# EAGLE design open-lab-VUSB-A (EAGLE 6.5.0)
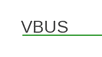
[diagram p0: schematic, sheet 1, part 1 of 2]
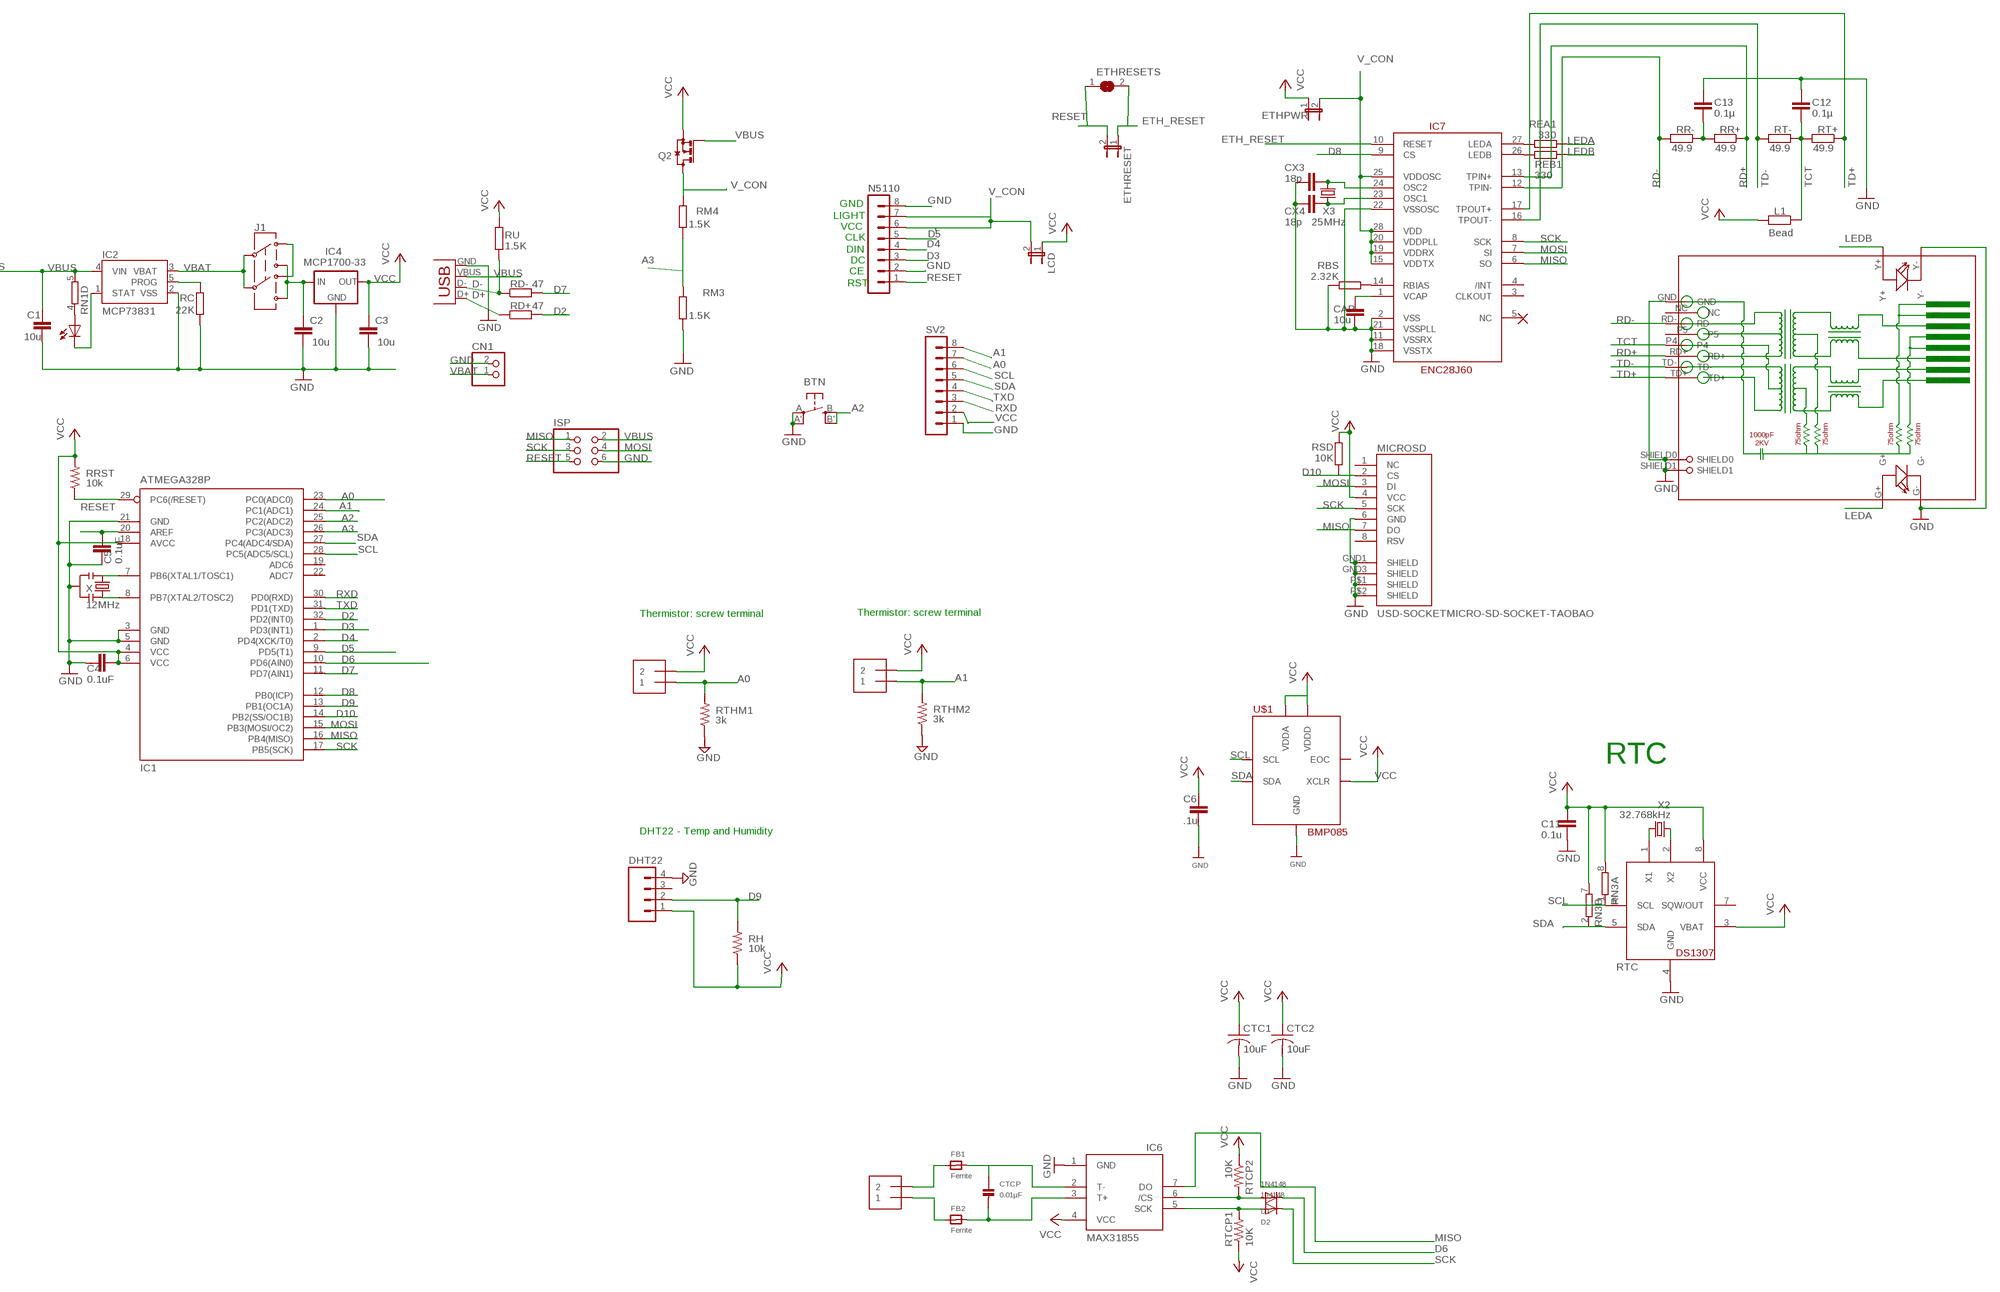
[diagram p1: schematic, sheet 1, part 2 of 2]

## Parts
BTN  EVQQ2  [EVQ-Q2]
C1  10u  C-EUC0805  [C0805]
C2  10u  C-EUC0805  [C0805]
C3  10u  C-EUC0805  [C0805]
C4  0.1uF  C-EUC0805  [C0805]
C5  0.1uF  C-EUC0805  [C0805]
C6  .1u  C-EUC0805  [C0805]
C11  0.1u  C-EUC0805  [C0805]
C12  0.1µ  C-EUC0805  [C0805]
C13  0.1µ  C-EUC0805  [C0805]
CAP  10u  C-EUC0805  [C0805]
CHG  0805  LEDCHIPLED_0805  [CHIPLED_0805]
CN1  JST_2PIN-SMT-RA  [JST-PH-2-SMT-RA]
CTC1  10uF  C-USC0805K  [C0805K]
CTC2  10uF  C-USC0805K  [C0805K]
CTCP  0.01µF  CAP_CERAMIC_0805  [_0805]
CX3  18p  C-EUC0805  [C0805]
CX4  18p  C-EUC0805  [C0805]
D1  1N4148  DIODESOD-323F  [SOD-323F]
D2  1n4148  DIODESOD-323F  [SOD-323F]
DHT22  M04LOCK  [1X04_LOCK]
ETHPWR  JP1E  [JP1]
ETHRESET  JP1E  [JP1]
ETHRESETS  SJ  [SJ]
FB1  Ferrite  FERRITE_0805  [_0805]
FB2  Ferrite  FERRITE_0805  [_0805]
IC1  ATMEGA328P  MEGA8-AI  [TQFP32-08]
IC2  MCP73831  [SOT23-5]
IC4  MCP1700-33  MCP1700SOT233  [SOT23]
IC6  MAX31855  MAX6675  [SO08]
IC7  ENC28J60  ENC28J60SO28LONG  [SOIC28WLONG]
ISP  PINHD-2X3  [2X03]
J1  AYZ0202  [AYZ0202]
L1  Bead  R-EU_R0805  [R0805]
LCD  JP1E  [JP1]
MICROSD  USD-SOCKETMICRO-SD-SOCKET-TAOBAO  [MICRO-SD-SOCKET-TAOBAO]
N5110  MA08-1  [MA08-1]
Q2  BSS123  [SOT23]
RBS  2.32K  R-EU_R0805  [R0805]
RC  22K  R-EU_R0805  [R0805]
RD+  47  R-EU_R0805  [R0805]
RD-  47  R-EU_R0805  [R0805]
REA1  330  R-EU_R0805  [R0805]
REB1  330  R-EU_R0805  [R0805]
RH  10k  R-US_R0805  [R0805@1]
RJ45  HR911105A  [HR911105A]
RM3  1.5K  R-EU_R0805  [R0805]
RM4  1.5K  R-EU_R0805  [R0805]
RN1  4R-NEXB38V  [EXB38V]
RN3  4R-NEXB38V  [EXB38V]
RR+  49.9  R-EU_R0805  [R0805]
RR-  49.9  R-EU_R0805  [R0805]
RRST  10k  R-US_R0805  [R0805@1]
RSD  10K  R-EU_R0805  [R0805]
RT+  49.9  R-EU_R0805  [R0805]
RT-  49.9  R-EU_R0805  [R0805]
RTC  DS1307  DS1307SOIC  [SO08]
RTCP1  10K  R-US_R0805  [R0805]
RTCP2  10K  R-US_R0805  [R0805]
RTHM1  3k  R-US_R0805  [R0805@1]
RTHM2  3k  R-US_R0805  [R0805@1]
RU  1.5K  R-EU_R0805  [R0805]
SV2  MA08-1  [MA08-1]
TCPL  1X2-3.5MM  [1X2-3.5MM]
THM1  1X2-3.5MM  [1X2-3.5MM]
THM2  1X2-3.5MM  [1X2-3.5MM]
U$1  BMP085  [BMP085]
X  12MHz  RESONATORSMD  [RESONATOR-SMD]
X1  USBSMD  [USB-MINIB]
X2  32.768kHz  CRYSTALTC26H  [TC26H]
X3  25MHz  CRYSTALHC49UV  [HC49U-V]

## Nets
A0: IC1.23(PC0(ADC0)) RTHM1.2 SV2.7 THM1.1
A1: IC1.24(PC1(ADC1)) RTHM2.2 SV2.8 THM2.1
A2: BTN.B'(S1) BTN.B(S) IC1.25(PC2(ADC2))
A3: IC1.26(PC3(ADC3)) RM3.2 RM4.1
AREF: C5.2 IC1.20(AREF)
CS: D1.A IC6.6(/CS) RTCP2.2
D2: IC1.32(PD2(INT0)) RD+.2
D3: IC1.1(PD3(INT1)) N5110.3
D4: IC1.2(PD4(XCK/T0)) N5110.4
D5: IC1.9(PD5(T1)) N5110.5
D6: D1.C IC1.10(PD6(AIN0))
D7: IC1.11(PD7(AIN1)) RD-.2
D8: IC1.12(PB0(ICP)) IC7.9(CS)
D9: DHT22.2 IC1.13(PB1(OC1A)) RH.2
D10: IC1.14(PB2(SS/OC1B)) MICROSD.2(CS) RSD.1
D+: RD+.1 X1.D+
D-: RD-.1 RU.1 X1.D-
ETH_RESET: ETHRESET.1 ETHRESETS.2 IC7.10(RESET)
GND: BTN.A'(P1) BTN.A(P) C1.2 C2.2 C3.2 C4.1 C5.1 C6.2 C11.2 C12.1 C13.1 CAP.2 CN1.2 CTC1.2 CTC2.2 CX3.2 CX4.2 DHT22.4 IC1.3(GND) IC1.5(GND) IC1.21(GND) IC2.2(VSS) IC4.1(GND) IC6.1(GND) IC7.2(VSS) IC7.11(VSSRX) IC7.18(VSSTX) IC7.21(VSSPLL) IC7.22(VSSOSC) ISP.6 MICROSD.6(GND) MICROSD.GND1(SHIELD) MICROSD.GND3(SHIELD) MICROSD.P$1(SHIELD) MICROSD.P$2(SHIELD) N5110.2 RBS.1 RC.1 RJ45.G- RJ45.GND RJ45.SHIELD0 RJ45.SHIELD1 RJ45.Y- RM3.1 RTC.4(GND) RTHM1.1 RTHM2.1 SV2.1 U$1.P$1(GND) X1.GND X.2
LEDA: REA1.2 RJ45.G+
LEDB: REB1.2 RJ45.Y+
MISO: IC1.16(PB4(MISO)) IC6.7(DO) IC7.6(SO) ISP.1 MICROSD.7(DO)
MOSI: IC1.15(PB3(MOSI/OC2)) IC7.7(SI) ISP.4 MICROSD.3(DI)
N$1: J1.3 J1.6
N$2: IC1.7(PB6(XTAL1/TOSC1)) X.1
N$3: IC1.8(PB7(XTAL2/TOSC2)) X.3
N$5: CHG.C IC2.1(STAT)
N$6: IC2.5(PROG) RC.2
N$8: FB1.1 TCPL.2
N$9: CTCP.1 FB1.2 IC6.2(T-)
N$10: CHG.A RN1.4
N$11: FB2.1 TCPL.1
N$12: CTCP.2 FB2.2 IC6.3(T+)
N$21: RTC.1(X1) X2.2
N$30: RTC.2(X2) X2.1
N$34: IC7.27(LEDA) REA1.1
N$37: IC7.26(LEDB) REB1.1
N$39: CAP.1 IC7.1(VCAP)
N$41: CX3.1 IC7.24(OSC2) X3.2
N$42: CX4.1 IC7.23(OSC1) X3.1
N$54: C13.2 RR+.2 RR-.1
N$59: IC7.14(RBIAS) RBS.2
RD+: IC7.13(TPIN+) RJ45.RD+ RR+.1
RD-: IC7.12(TPIN-) RJ45.RD- RR-.2
RESET: ETHRESET.2 ETHRESETS.1 IC1.29(PC6(/RESET)) ISP.5 N5110.1 RRST.1
RXD: IC1.30(PD0(RXD)) SV2.3
SCK: D2.C IC1.17(PB5(SCK)) IC7.8(SCK) ISP.3 MICROSD.5(SCK)
SCK1: D2.A IC6.5(SCK) RTCP1.2
SCL: IC1.28(PC5(ADC5/SCL)) RN3.1 RTC.6(SCL) SV2.6 U$1.P$6(SCL)
SDA: IC1.27(PC4(ADC4/SDA)) RN3.2 RTC.5(SDA) SV2.5 U$1.P$7(SDA)
TCT: C12.2 L1.1 RJ45.P4 RT+.2 RT-.1
TD+: IC7.17(TPOUT+) RJ45.TD+ RT+.1
TD-: IC7.16(TPOUT-) RJ45.TD- RT-.2
TXD: IC1.31(PD1(TXD)) SV2.4
V_CON: ETHPWR.2 IC7.15(VDDTX) IC7.19(VDDRX) IC7.20(VDDPLL) IC7.25(VDDOSC) IC7.28(VDD) LCD.2 N5110.6 N5110.7 Q2.3(D) RM4.2
VBAT: CN1.1 IC2.3(VBAT) J1.2 J1.5
VBUS: C1.1 IC2.4(VIN) ISP.2 Q2.1(G) RN1.5 X1.VBUS
VCC: C3.1 C4.2 C6.1 C11.1 CTC1.1 CTC2.1 DHT22.1 ETHPWR.1 IC1.4(VCC) IC1.6(VCC) IC1.18(AVCC) IC4.2(OUT) IC6.4(VCC) L1.2 LCD.1 MICROSD.4(VCC) Q2.2(S) RH.1 RN3.7 RN3.8 RRST.2 RSD.2 RTC.3(VBAT) RTC.8(VCC) RTCP1.1 RTCP2.1 RU.2 SV2.2 THM1.2 THM2.2 U$1.P$3(VDDA) U$1.P$4(VDDD) U$1.P$8(XCLR)
VDD: C2.1 IC4.3(IN) J1.1 J1.4
Unconnected: DHT22.3 IC1.19(ADC6) IC1.22(ADC7) IC7.3(CLKOUT) IC7.4(/INT) IC7.5(NC) MICROSD.1(NC) MICROSD.8(RSV) N5110.8 RJ45.NC RJ45.P5 RN1.1 RN1.2 RN1.3 RN1.6 RN1.7 RN1.8 RN3.3 RN3.4 RN3.5 RN3.6 RTC.7(SQW/OUT) U$1.P$2(EOC)

## Notes on the sheet
- GND
- LIGHT
- VCC
- CLK
- DIN
- DC
- CE
- RST
- Thermistor: screw terminal | Thermistor: screw terminal
- RTC
- DHT22 - Temp and Humidity

## Library data of the parts
BTN = adafruit:EVQQ2: SMT 6mm switch, EVQQ2 series http://www.ladyada.net/library/eagle
C1-C3 C6 C12 C13 CAP CX3 CX4 = resistor:C-EU: CAPACITOR, European symbol
C4 C5 C11 = rcl:C-EU: CAPACITOR, European symbol
CHG = led:LED: LED OSRAM: - CHIPLED LG R971, LG N971, LY N971, LG Q971, LY Q971, LO R971, LY R971 LH N974, LH R974 LS Q976, LO Q976, LY Q976 LO Q996 - Hyper CHIPLED LW Q18S LB Q993, LB Q99A, LB R99A - SideLED LS A670, LO A670, LY A670, LG A670, LP A670 LB A673, LV A673, LT A673, LW A673 LH A674 LY A675 LS A676, LA A676, LO A676, LY A676, LW A676 LS A679, LY A679, LG A679 - Hyper Micro SIDELED® LS Y876, LA Y876, LO Y876, LY Y876 LT Y87S - SmartLED LW L88C, LW L88S LB L89C, LB L89S, LG L890 LS L89K, LO L89K, LY L89K LS L896, LA L896, LO L896, LY L896 - TOPLED LS T670, LO T670, LY T670, LG T670, LP T670 LSG T670, LSP T670, LSY T670, LOP T670, LYG T670 LG T671, LOG T671, LSG T671 LB T673, LV T673, LT T673, LW T673 LH T674 LS T676, LA T676, LO T676, LY T676, LB T676, LH T676, LSB T676, LW T676 LB T67C, LV T67C, LT T67C, LS T67K, LO T67K, LY T67K, LW E67C LS E67B, LA E67B, LO E67B, LY E67B, LB E67C, LV E67C, LT E67C LW T67C LS T679, LY T679, LG T679 LS T770, LO T770, LY T770, LG T770, LP T770 LB T773, LV T773, LT T773, LW T773 LH T774 LS E675, LA E675, LY E675, LS T675 LS T776, LA T776, LO T776, LY T776, LB T776 LHGB T686 LT T68C, LB T68C - Hyper Mini TOPLED® LB M676 - Mini TOPLED Santana® LG M470 LS M47K, LO M47K, LY M47K Source: http://www.osram.convergy.de LUXEON: - LUMILED® LXK2-PW12-R00, LXK2-PW12-S00, LXK2-PW14-U00, LXK2-PW14-V00 LXK2-PM12-R00, LXK2-PM12-S00, LXK2-PM14-U00 LXK2-PE12-Q00, LXK2-PE12-R00, LXK2-PE12-S00, LXK2-PE14-T00, LXK2-PE14-U00 LXK2-PB12-K00, LXK2-PB12-L00, LXK2-PB12-M00, LXK2-PB14-N00, LXK2-PB14-P00, LXK2-PB14-Q00 LXK2-PR12-L00, LXK2-PR12-M00, LXK2-PR14-Q00, LXK2-PR14-R00 LXK2-PD12-Q00, LXK2-PD12-R00, LXK2-PD12-S00 LXK2-PH12-R00, LXK2-PH12-S00 LXK2-PL12-P00, LXK2-PL12-Q00, LXK2-PL12-R00 Source: www.luxeon.com KINGBRIGHT: KA-3528ASYC Source: www.kingbright.com
CN1 = adafruit:JST_2PIN: JST 2-Pin Connectors of various flavors SMT-RA (S2B-PH-SM4) 4UConnector #17311 SMT (B2B-PH-SM4) THM-RA (S2B-PH) THM (B2B-PH)
CTC1 CTC2 = adafruit:C-US: CAPACITOR, American symbol
CTCP = microbuilder:CAP_CERAMIC: Ceramic Capacitors 0402 - 0402 Surface Mount Capacitors 16pF 50V 5% [Digikey: 445-4899-2-ND] 18pF 50V 5% [Digikey: 490-1281-2-ND] 22pF 50V 5% [Digikey: 490-1283-2-ND] 68pF 50V 5% [Digikey: 490-1289-2-ND] 0.1uF 10V 10% [Digikey: 490-1318-2-ND] 1.0uF 6.3V 10% [Digikey: 490-1320-2-ND] 0603 - 0603 Surface Mount Capacitors 16 pF 50V 5% [Digikey: 445-5051-2-ND] 22 pF 50V [Digikey: PCC220ACVTR-ND] 33 pF 50V 5% [Digikey: 490-1415-1-ND] 56pF 50V 5% [Digikey: 490-1421-1-ND] 220pF 50V 5% [Digikey: 445-1285-1-ND] 680 pF 50V 2200 pF 50V 5% C0G [Digikey: 445-1297-1-ND] 5600 pF 100V 5% X7R [Digikey: 478-3711-1-ND] 0.1 µF 25V 10% [Digikey: PCC2277TR-ND] 0.22 µF 16V 10% X7R [Digikey: 445-1318-1-ND] 1.0 µF 25V 10% [Digikey: 445-5146-2-ND] 0603 - RF Specific 3pF 250V +/-0.1pF RF [Digikey: 712-1347-1-ND] 18 pF 250V 5% [Digikey: 478-3505-1-ND or 712-1322-1-ND] 56 pF 250V 5% C0G RF [Digikey: 490-4867-1-ND] 68 pF 250V RF [Digikey: 490-4868-1-ND] 0805 - 0805 Surface Mount Capacitors 220 pF 250V 2% RF Ceramic Capacitor [Digikey: 712-1398-1-ND] 1000 pF 50V 2% NP0 Ceramic Capacitor [Digikey: 478-3760-1-ND] 0.1 µF 25V 10% Ceramic Capacitor [Digikey: PCC1828TR-ND] 1.0 µF 16V 10% Ceramic Capacitor[Digikey: 490-1691-2-ND] 10.0 µF 10V 10% Ceramic Capacitor[Digikey: 709-1228-1-ND] 10.0 uF 16V 10% Ceramic Capacitor [Digikey: 478-5165-2-ND] 47 uF 6.3V 20% Ceramic Capacitor [Digikey: 587-1779-1-ND or 399-5506-1-ND] 1206 - 1206 Surface Mount Capacitors 47uF 10V 20% Ceramic Capacitor [Digikey: 490-5528-1-ND or 399-5508-1-ND or 445-6010-1-ND] 100uF 6.3V -20%, +80% Y5V Ceramic Capacitor (Digikey: 490-4512-1-ND, Mouser: 81-GRM31CF50J107ZE1L)
D1 D2 = adafruit:DIODE: Diode SMADIODE - SMA Surface Mount Package 20V 1A Schottky Diode Digikey: 641-1014-6-ND DO-1N4148 - Through Hole Small Current Diode SOD-123 20V 1 A (.5mV Vf) Schottky Diode - Digikey: MBRX120TPMSCT-ND SOD-323 10V 570mA (.38mV Vf, 3ns) Schottky Diode - Digikey: ZLLS410CT-ND SOD-523 30V 30mA Schottky Diode (RB751S-40TE61) - Digikey: RB751S-40TE61CT-ND SOT23-R/W - SOT23 Package (R = Solder Paste/Reflow Ovens, W = Hand-Soldering) BAT54Film 40V 300mA - Digikey: 497-7162-1-ND
DHT22 = SparkFun-Connectors:M04: Header 4 Standard 4-pin 0.1" header. Use with straight break away headers (SKU : PRT-00116), right angle break away headers (PRT-00553), swiss pins (PRT-00743), machine pins (PRT-00117), and female headers (PRT-00115). Molex polarized connector foot print use with SKU : PRT-08231 with associated crimp pins and housings. 1MM SMD Version SKU: PRT-10208
ETHPWR ETHRESET LCD = jumper:JP1E: JUMPER
ETHRESETS = jumper:SJ: SMD solder JUMPER
FB1 FB2 = microbuilder:FERRITE: Ferrite Bead 0603 MMZ1608B121C - 120 Ohm @ 100MHz, 600mA, 0.15 Ohm DC Resistance - Digikey: 445-2164-1-ND BK1608HW121-T - 120 Ohm, 600mA Ferrite Chip - Digikey: 587-1876-2-ND 0805 HZ0805B272R-10 - 2.7K Ohm @ 100MHz, 200mA, 0.8 Ohm DC Resistance - Digikey: 240-2504-1-ND (see also Murata BLM21BD272SN1L) MMZ2012Y152B - 1.5K Ohm @ 100MHz, 500mA, 0.4 Ohm DC Resistance - Digikey: 445-1560-1-ND - Mainly for high frequency (80-400MHz) MMZ2012R102A - 1K Ohm @ 100MHz, 500mA, 0.3 Ohm DC Resistance - Digikey: 445-1555-2-ND - More general purpose (10-200MHz)
IC1 = atmel:MEGA8: MICROCONTROLLER 8 Kbytes FLASH, 1 kbytes SRAM, 512 bytes EEPROM, USART, 6-channel 10 bit ADC, 2-channel 8 bit ADC Pin compatible with Atmega48, ATMega88, ATMega168 Source: avr.lbr; MPN: ATMEGA8-16AU; OC_FARNELL: 9171371; OC_NEWARK: 73M8863
IC2 = SparkFunNew:MCP73831: Microchip's MCP73831 Miniature single cell, fully integrated Li-Ion, Li-polymer charge management controller http://ww1.microchip.com/downloads/en/DeviceDoc/21984a.pdf
IC4 = adafruit:MCP1700: VOLTAGE REGULATOR
IC6 = adafruit:MAX6675
IC7 = SparkFun:ENC28J60
ISP = pinhead:PINHD-2X3: PIN HEADER
J1 = SparkFunNew:AYZ0202: SPDT Slide Switch Simple SMD single-pull double-throw slide switch. Good for less than 350mA power switch, switching UARTs between devices, etc. Spark Fun Electronics SKU : COM-00597
L1 RBS RC RD+ RD- REA1 REB1 RM3 RM4 RR+ RR- RSD RT+ RT- RU = rcl:R-EU_: RESISTOR, European symbol
MICROSD = SparkFunNew:USD-SOCKET: microSD Socket Push-push type uSD socket. Schematic element and footprint production proven. Spark Fun Electronics SKU : PRT-00127. tDoc lines correctly indicate media card edge positions when inserting (unlocked, locked, depressed).
N5110 SV2 = con-lstb:MA08-1: PIN HEADER; OC_FARNELL: unknown; OC_NEWARK: unknown
Q2 = transistor-small-signal:BSS123: N-CHANNEL MOS FET
RH RRST RTHM1 RTHM2 = rcl:R-US_: RESISTOR, American symbol
RJ45 = CONNECTER:HR911105A
RN1 RN3 = resistor-dil:4R-N: Array Chip Resistor Source: RS Component / Phycomp; OC_FARNELL: unknown; OC_NEWARK: unknown
RTC = adafruit:DS1307: DS1307 Real time clock (RTC) with battery backup ability. Talk to it via i2c
RTCP1 RTCP2 = adafruit:R-US_: RESISTOR, American symbol
TCPL THM1 THM2 = adafruit:1X2: 3.5mm Terminal block http://www.ladyada.net/library/pcb/eaglelibrary.html
U$1 = JeeLabs:BMP085: BMP086 Bosch Digital Pressure Sensor
X = SparkFunNew:RESONATOR: Resonator Small SMD resonator. This is the itty bitty 10/20MHz resonators with built in caps. CSTCE10M0G55 and CSTCE20M0V53. Footprint has been reviewed closely but hasn't been tested yet.
X1 = SparkFun:USB: USB Connectors USB-B-PTH is fully proven SKU : PRT-00139 USB-miniB is fully proven SKU : PRT-00587 USB-A-PCB is untested. USB-A-H is throughly reviewed, but untested. Spark Fun Electronics SKU : PRT-00437 USB-B-SMT is throughly reviewed, but untested. Needs silkscreen touching up. USB-A-S has not been used/tested USB-MB-H has not been used/tested
X2 = crystal:CRYSTAL: CRYSTAL; OC_FARNELL: unknown; OC_NEWARK: unknown
X3 = SparkFun:CRYSTAL: Crystals Various standard crystals. Proven footprints. Spark Fun Electronics SKU : COM-00534

## Net classes
0 default: width 0.203 mm
1 power: width 0.381 mm

## Board
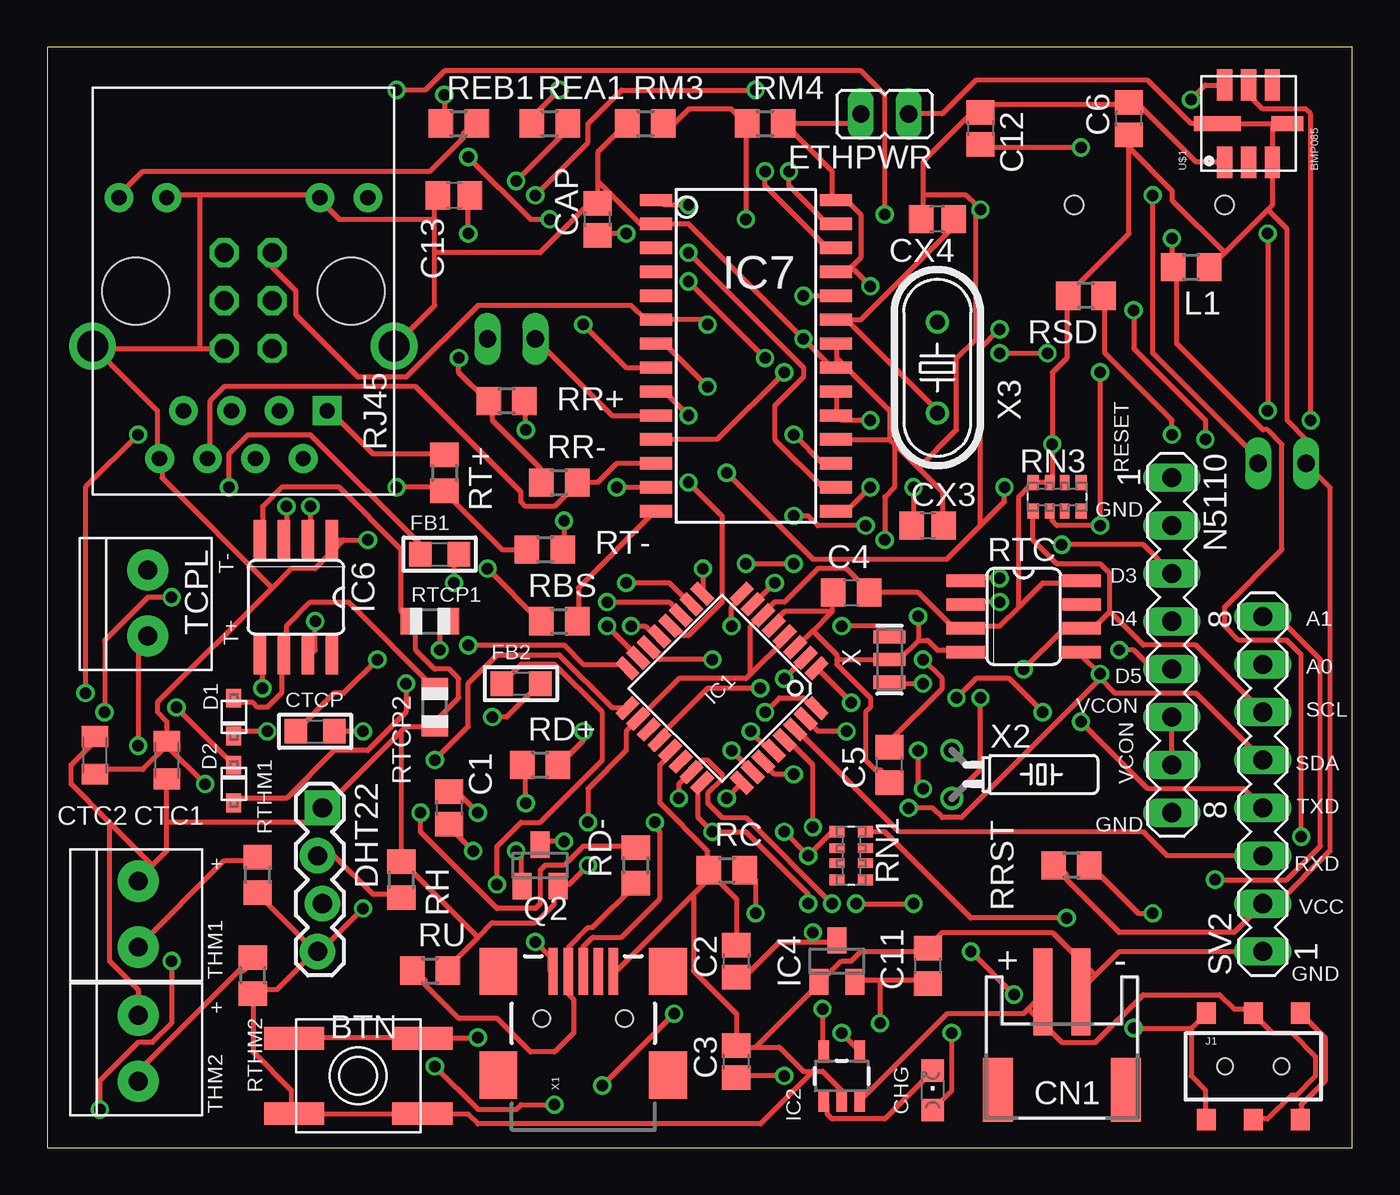
[diagram p2: board, top side]
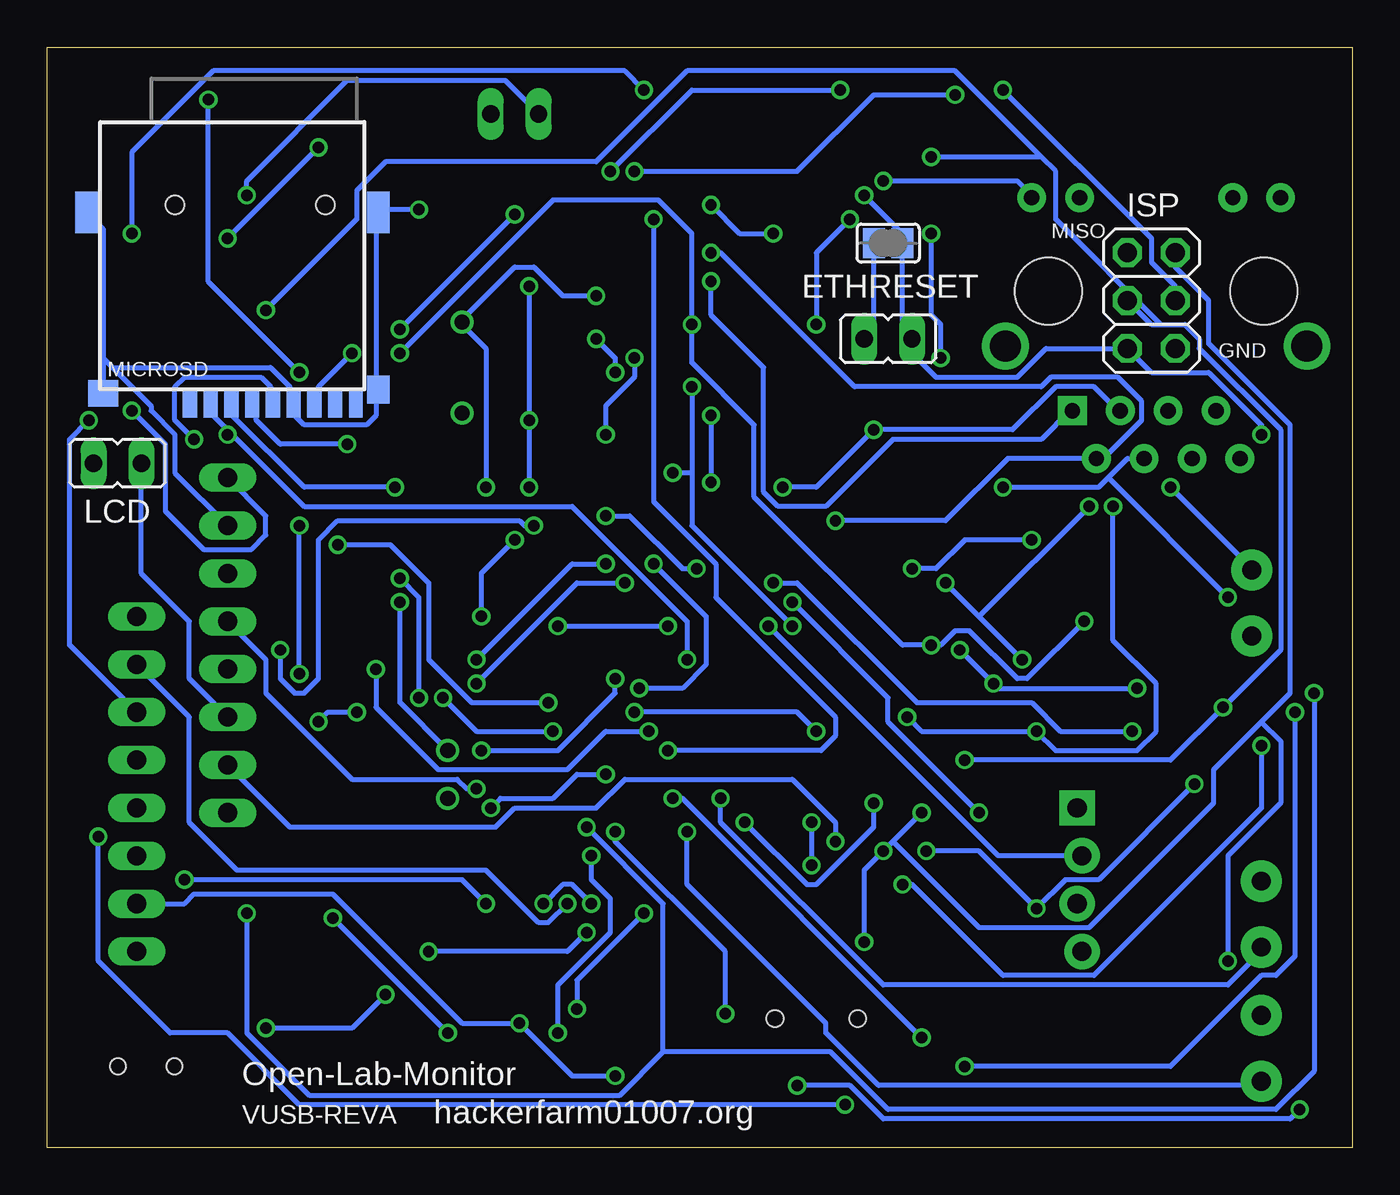
[diagram p3: board, bottom side, seen from below]

Size 69.27 x 58.41 mm. Coordinates in mm from the lower left corner, seen from the top.
Outline: 0,0 69.27,0 69.27,58.41 0,58.41 0,0
Copper layers (1*16): Top 0.0356mm / dielectric 1.5011mm / Bottom 0.0356mm
Design rules "LaenPCBOrder": minimum track width 6mil, minimum drill 13mil, track to track 6mil, track to pad 6mil, pad to pad 6mil, via to via 6mil, smd to smd 6mil, copper to edge 15mil, drill to drill 6mil, minimum pad ring 7mil, minimum via ring 7mil, stop-mask expansion 3mil, vias tented up to drill 0mil, thermal gap 10mil

### Footprints (pad centres in the part's own frame; a part is rotated, then mirrored left to right if it is on the bottom)
EVQ-Q2 = smd 3.2 x 1.2: A -3.4,-2; A' 3.4,-2; B -3.4,2; B' 3.4,2
C0805 = smd 1.3 x 1.5: 1 -0.85,0; 2 0.85,0
C0805' = smd 1.3 x 1.5: 1 -0.95,0; 2 0.95,0
CHIPLED_0805 = smd 1.2 x 1.2: A 0,-1.05; C 0,1.05
JST-PH-2-SMT-RA = smd 1 x 4.6: 1 1,-3.7; 2 -1,-3.7 | smd 1.6 x 3.4: NC1 -3.4,1.5; NC2 3.4,1.5
C0805K = smd 1.1 x 1.4: 1 -1,0; 2 1,0
_0805 = smd 1.2 x 1.3: 1 -1.016,0; 2 1.016,0
SOD-323F = smd 1 x 0.8: A -1,0; C 1,0
1X04_LOCK = drill 1.016 pad 1.88 square: 1 0,0.127 | drill 1.016 pad 1.88: 2 2.54,-0.127; 3 5.08,0.127; 4 7.62,-0.127
JP1 = drill 0.914 long: 1 0,-1.27; 2 0,1.27
SJ = smd 1.168 x 1.6: 1 -0.762,0; 2 0.762,0
TQFP32-08 = smd 1.27 x 0.559: 1 -4.293,2.8; 2 -4.293,2; 3 -4.293,1.2; 4 -4.293,0.4; 5 -4.293,-0.4; 6 -4.293,-1.2; 7 -4.293,-2; 8 -4.293,-2.8; 17 4.293,-2.8; 18 4.293,-2; 19 4.293,-1.2; 20 4.293,-0.4; 21 4.293,0.4; 22 4.293,1.2; 23 4.293,2; 24 4.293,2.8 | smd 0.559 x 1.27: 9 -2.8,-4.293; 10 -2,-4.293; 11 -1.2,-4.293; 12 -0.4,-4.293; 13 0.4,-4.293; 14 1.2,-4.293; 15 2,-4.293; 16 2.8,-4.293; 25 2.8,4.293; 26 2,4.293; 27 1.2,4.293; 28 0.4,4.293; 29 -0.4,4.293; 30 -1.2,4.293; 31 -2,4.293; 32 -2.8,4.293
SOT23-5 = smd 0.55 x 1.2: 1 -0.95,-1.3; 2 0,-1.3; 3 0.95,-1.3; 4 0.95,1.3; 5 -0.95,1.3
SOT23 = smd 1 x 1.4: 1 -0.95,-1.1; 2 0.95,-1.1; 3 0,1.1
SO08 = smd 0.66 x 2.032: 1 -1.905,-3.073; 2 -0.635,-3.073; 3 0.635,-3.073; 4 1.905,-3.073; 5 1.905,3.073; 6 0.635,3.073; 7 -0.635,3.073; 8 -1.905,3.073
SOIC28WLONG = smd 0.65 x 1.7: 1 -8.89,-4.78; 2 -7.62,-4.78; 3 -6.35,-4.78; 4 -5.08,-4.78; 5 -3.81,-4.78; 6 -2.54,-4.78; 7 -1.27,-4.78; 8 0,-4.78; 9 1.27,-4.78; 10 2.54,-4.78; 11 3.81,-4.78; 12 5.08,-4.78; 13 6.35,-4.78; 14 7.62,-4.78; 15 7.62,4.78; 16 6.35,4.78; 17 5.08,4.78; 18 3.81,4.78; 19 2.54,4.78; 20 1.27,4.78; 21 0,4.78; 22 -1.27,4.78; 23 -2.54,4.78; 24 -3.81,4.78; 25 -5.08,4.78; 26 -6.35,4.78; 27 -7.62,4.78; 28 -8.89,4.78
2X03 = drill 1.016 octagon: 1 -2.54,-1.27; 2 -2.54,1.27; 3 0,-1.27; 4 0,1.27; 5 2.54,-1.27; 6 2.54,1.27
AYZ0202 = smd 1 x 1.15: 1 -2.5,2.825; 2 0,2.825; 3 2.5,2.825; 4 -2.5,-2.825; 5 0,-2.825; 6 2.5,-2.825 | hole 0.85: 1.5,0; -1.5,0
R0805 = smd 1.3 x 1.5: 1 -0.95,0; 2 0.95,0
MICRO-SD-SOCKET-TAOBAO = smd 0.75 x 1.6: 1 2.25,10.5; 2 1.15,10.5; 3 0.05,10.5; 4 -1.05,10.5; 5 -2.15,10.5; 6 -3.25,10.5; 7 -4.35,10.5; 8 -5.45,10.5 | smd 0.7 x 1.6: CD -6.55,10.5 | smd 1.2 x 1.5: GND1 -7.75,9.8 | smd 1.6 x 1.4: GND3 6.85,10 | smd 1.2 x 2.2: P$1 7.75,0.4; P$2 -7.75,0.4 | hole 1: 3.05,0; -4.93,0
MA08-1 = drill 1.016 long: 1 -8.89,0; 2 -6.35,0; 3 -3.81,0; 4 -1.27,0; 5 1.27,0; 6 3.81,0; 7 6.35,0; 8 8.89,0
R0805@1 = smd 1.3 x 1.5: 1 -0.95,0; 2 0.95,0
HR911105A = drill 0.813 pad 1.524: G+ 4.953,-6.604; G- 4.953,-4.064; GND -8.89,4.445; NC -6.35,3.175; P4 -8.89,-0.635; P5 -6.35,0.635; RD+ -6.35,-1.905; RD- -8.89,1.905; TD- -8.89,-3.175; Y+ 4.953,6.604; Y- 4.953,4.064 | drill 1.651 pad 2.159: SHIELD0 -2.921,8.001; SHIELD1 -2.921,-8.001 | drill 0.813 pad 1.524 square: TD+ -6.35,-4.445 | hole 3.556: 0,-5.715; 0,5.715
EXB38V = smd 0.6 x 0.8: 1 -1.275,-0.75; 4 1.275,-0.75; 5 1.275,0.75; 8 -1.275,0.75 | smd 0.5 x 0.8: 2 -0.4,-0.75; 3 0.4,-0.75; 6 0.4,0.75; 7 -0.4,0.75
R0805' = smd 1.1 x 1.4: 1 -1,0; 2 1,0
1X2-3.5MM = drill 1 pad 2.184: 1 1.8,0; 2 -1.7,0
BMP085 = smd 1.68 x 0.8: P$1 -2.06,1.27; P$2 -2.06,0; P$3 -2.06,-1.27; P$5 2.04,-1.27; P$6 2.04,0; P$7 2.04,1.27 | smd 0.8 x 1.68: P$4 0,-2.06 | smd 0.8 x 2.5: P$8 0,1.65
RESONATOR-SMD = smd 0.7 x 1.7: 1 -1.2,0; 2 0,0; 3 1.2,0
USB-MINIB = smd 2.5 x 0.5: D+ 2.5,0; D- 2.5,0.8; GND 2.5,-1.6; ID 2.5,-0.8; VBUS 2.5,1.6 | smd 2.5 x 2: GND@1 -3,-4.5; GND@2 -3,4.5; GND@3 2.5,4.5; GND@4 2.5,-4.5 | hole 0.9: 0,2.2; 0,-2.2
TC26H = drill 0.813: 1 -1.27,0; 2 1.27,0
HC49U-V = drill 0.813: 1 -2.413,0; 2 2.413,0

### Placement (x,y rotation side)
BTN  16.51,3.81 0 top
C1  21.34,18.03 270 top
C2  36.58,9.91 90 top
C3  36.58,4.57 90 top
C4  0.1uF  [C0805']  42.67,29.46 0 top
C5  0.1uF  [C0805']  44.7,20.32 90 top
C6  57.4,54.61 90 top
C11  0.1u  [C0805']  46.74,9.65 90 top
C12  49.53,54.1 270 top
C13  21.59,50.55 0 top
CAP  29.21,49.28 90 top
CHG  46.99,3.05 0 top
CN1  53.85,4.57 180 top
CTC1  6.35,20.57 90 top
CTC2  2.54,20.83 270 top
CTCP  14.22,22.1 0 top
CX3  46.74,33.02 0 top
CX4  47.24,49.28 180 top
D1  9.91,22.86 270 top
D2  9.91,19.3 90 top
DHT22  14.48,18.03 270 top
ETHPWR  44.45,54.86 90 top
ETHRESET  24.64,42.93 270 bottom
ETHRESETS  24.64,48.01 180 bottom
FB1  20.83,31.5 0 top
FB2  25.15,24.64 0 top
IC1  35.81,24.38 225 top
IC2  42.16,3.81 0 top
IC4  41.91,9.91 0 top
IC6  13.21,29.21 180 top
IC7  37.08,41.4 270 top
ISP  10.67,44.96 270 bottom
J1  64.01,4.32 0 top
L1  60.71,46.74 0 top
LCD  65.53,36.32 270 bottom
MICROSD  59.44,50.04 180 bottom
N5110  59.69,26.67 270 top
Q2  26.16,14.99 0 top
RBS  27.18,27.94 0 top
RC  36.07,14.73 0 top
RD+  26.16,20.32 0 top
RD-  31.24,14.99 90 top
REA1  26.67,54.36 0 top
REB1  21.84,54.36 0 top
RH  18.8,14.22 270 top
RJ45  10.41,45.47 90 top
RM3  31.75,54.36 0 top
RM4  38.1,54.36 0 top
RN1  42.67,15.49 90 top
RN3  53.59,34.54 0 top
RR+  24.38,39.62 180 top
RR-  27.18,35.31 0 top
RRST  54.36,14.99 180 top
RSD  55.12,45.21 180 top
RT+  21.08,35.81 270 top
RT-  26.42,31.75 0 top
RTC  51.82,28.19 270 top
RTCP1  10K  [R0805']  20.32,27.94 0 top
RTCP2  10K  [R0805']  20.57,23.37 90 top
RTHM1  11.18,14.48 90 top
RTHM2  10.92,9.14 90 top
RU  20.32,9.4 0 top
SV2  64.52,19.3 90 top
TCPL  5.33,28.96 270 top
THM1  4.83,12.45 270 top
THM2  4.83,5.33 270 top
U$1  63.75,54.36 90 top
X  44.7,25.91 90 top
X1  28.45,6.86 90 top
X2  48.01,19.81 270 top
X3  47.24,41.4 90 top

### Tracks (layer width: path | path; a pad name or v marks a point on that pad's centre or on a via)
A0  (via drill 0.61)
  Top 0.254: v33.53,18.54 33.53,19.3 34.04,19.81 IC1.23 34.29,20.07 34.8,20.57 35.05,20.57 35.81,19.81 35.81,19.56 35.05,18.8 35.05,18.29 35.81,17.53 37.08,17.53 v41.66,12.95 | RTHM1.2 11.18,15.24 9.4,15.24 4.83,10.67 THM1.1
  Bottom 0.254: v33.53,18.54 33.53,17.27 24.89,8.64 6.6,8.64 4.83,10.41 THM1.1 | SV2.7 61.72,22.86 61.72,17.27 59.18,14.73 45.97,14.73 43.18,11.94 42.67,11.94 v41.66,12.95
A1  (via drill 0.61)
  Top 0.254: IC1.24 34.54,19.3 34.54,17.53 v35.31,16.76 37.08,16.76 40.39,13.46 v40.39,12.95 | THM2.1 4.83,4.06 10.16,9.4 10.41,9.4 10.92,9.91 RTHM2.2 | SV2.8 65.28,28.19 67.56,25.91 67.56,16 65.79,14.22 v61.98,14.22 | v42.93,12.95 v45.97,12.95
  Bottom 0.254: v35.31,16.76 35.31,13.97 27.94,6.6 27.94,6.1 25.15,3.3 4.83,3.3 THM2.1 | v61.98,14.22 47.24,14.22 v45.97,12.95 | v42.93,12.95 41.91,13.97 41.4,13.97 v40.39,12.95
A2  (via drill 0.61)
  Top 0.254: v36.07,18.54 36.83,19.3 IC1.25 | v22.86,5.84 20.07,5.84 BTN.B' 19.81,5.84 13.21,5.84 BTN.B
  Bottom 0.254: v36.07,18.54 35.56,18.54 v22.86,5.84
A3  (via drill 0.61)
  Top 0.254: v36.32,21.08 37.34,20.07 IC1.26 | 37.08,54.36 v37.08,49.28 | RM3.2 33.27,54.36 34.04,55.12 36.32,55.12 37.08,54.36 | 37.08,54.36 RM4.1
  Bottom 0.254: v36.32,21.08 28.19,21.08 27.43,21.84 27.43,22.86 33.78,29.21 33.78,30.99 37.08,34.29 v37.08,49.28
AREF  (via drill 0.61)
  Top 0.254: v37.85,24.38 35.05,24.38 32.51,21.84 IC1.20 | v39.62,30.99 v37.08,30.99 | v46.48,25.91 47.5,24.89 47.5,24.38 44.7,21.59 C5.2
  Bottom 0.254: v37.85,24.38 35.56,24.38 34.29,25.65 34.29,28.19 v37.08,30.99 | v39.62,30.99 41.4,30.99 v46.48,25.91
CS
  Top 0.254: D1.A 9.91,23.62 10.92,23.62 11.18,23.37 11.68,23.37 12.45,24.13 12.45,25.91 IC6.6 12.7,26.16 12.7,27.69 13.97,28.96 16,28.96 20.57,24.38 RTCP2.2
D2  (via drill 0.61)
  Top 0.254: v38.1,23.11 38.86,23.88 40.13,23.88 40.64,23.37 IC1.32 | v28.45,22.1 28.45,21.59 27.18,20.32 RD+.2
  Bottom 0.254: v38.1,23.11 29.46,23.11 v28.45,22.1
D3  (via drill 0.61)
  Top 0.254: v42.67,23.62 40.89,25.4 IC1.1 | v53.85,32 58.17,32 N5110.3
  Bottom 0.254: v42.67,23.62 46.74,23.62 49.02,25.91 49.02,29.97 51.05,32 v53.85,32
D4  (via drill 0.61)
  Top 0.254: v39.12,24.89 40.13,25.91 IC1.2 | v46.23,21.08 46.23,19.3 v46.48,19.05
  Bottom 0.254: v39.12,24.89 39.12,24.13 42.16,21.08 v46.23,21.08 | v46.48,19.05 46.99,19.05 47.5,19.56 53.09,19.56 57.66,24.13 57.66,25.91 N5110.4
D5  (via drill 0.61)
  Top 0.254: v34.8,30.73 34.8,29.46 IC1.9 | v39.62,33.53 40.39,33.53 40.89,33.02 v43.43,33.02 | v56.9,26.42 57.66,26.42 58.67,25.4 N5110.5
  Bottom 0.254: v34.8,30.73 35.56,30.73 38.35,33.53 v39.62,33.53 | v43.43,33.02 43.94,33.02 44.2,33.27 53.85,33.27 54.86,32.26 54.86,24.89 55.63,24.13 56.13,24.13 56.9,24.89 v56.9,26.42
D6  (via drill 0.61)
  Top 0.254: v11.68,22.1 9.91,22.1 D1.C | v30.73,29.97 33.02,29.97 34.04,28.96 IC1.10
  Bottom 0.254: v11.68,22.1 15.49,22.1 17.02,23.62 23.11,23.62 29.46,29.97 v30.73,29.97
D7  (via drill 0.61)
  Top 0.254: v29.72,28.96 33.02,28.96 33.53,28.45 IC1.11 | v19.81,17.78 19.81,16.76 23.88,12.7 25.91,12.7 26.16,12.95 26.16,14.73 26.42,14.99 27.43,14.99 28.45,16 31.24,16 RD-.2
  Bottom 0.254: v29.72,28.96 24.64,23.88 24.64,22.61 v19.81,17.78
D8  (via drill 0.61)
  Top 0.254: v34.04,35.31 35.81,33.53 35.81,28.96 34.04,27.18 33.78,27.18 33.27,27.69 IC1.12 | v34.04,38.86 32.77,40.13 IC7.9
  Bottom 0.254: v34.04,38.86 v34.04,35.31
D9  (via drill 0.61)
  Top 0.254: v30.99,27.69 31.75,27.69 32.26,27.18 IC1.13 | DHT22.2 15.24,15.49 17.27,13.46 18.8,13.46 RH.2
  Bottom 0.254: v30.99,27.69 18.8,15.49 DHT22.2
D10  (via drill 0.61)
  Top 0.254: v35.31,25.91 32.51,25.91 32,26.42 IC1.14 | v59.69,37.85 59.69,38.61 56.13,42.16 56.13,45.21 RSD.1
  Bottom 0.254: v35.31,25.91 35.31,27.94 41.4,34.04 55.63,34.04 59.44,37.85 | 59.44,37.85 60.45,38.86 60.45,39.37 MICROSD.2 | 59.44,37.85 v59.69,37.85
D+  (via drill 0.61)
  Top 0.254: v25.4,18.29 25.4,20.32 RD+.1 | v32.26,17.27 32.26,17.02 32.51,16.76 32.51,13.21 30.48,11.18 28.96,11.18 28.45,10.67 X1.D+
  Bottom 0.254: v25.4,18.29 25.4,17.02 28.45,13.97 28.96,13.97 v32.26,17.27
D-
  Top 0.254: RU.1 19.56,9.4 20.07,8.89 20.07,8.64 21.84,6.86 23.88,6.86 25.65,5.08 26.92,5.08 27.94,6.1 27.94,7.87 27.69,8.13 27.69,9.14 X1.D- 27.69,9.4 27.69,10.67 28.7,11.68 28.96,11.68 31.24,13.97 RD-.1
ETH_RESET
  Top 0.254: IC7.10 29.97,38.86 ETHRESET.1
  Bottom 0.254: ETHRESETS.2 25.4,43.43 ETHRESET.1
GND  (via drill 0.61)
  Top 0.254: 14.22,10.41 12.19,8.38 10.92,8.38 RTHM2.1 10.92,5.08 12.95,3.05 12.95,2.03 BTN.A 13.21,1.78 19.81,1.78 BTN.A' 20.07,1.78 22.35,1.78 22.86,1.27 37.85,1.27 40.64,4.06 | 14.22,10.41 11.18,13.46 RTHM1.1 | 14.22,10.41 DHT22.4 14.48,10.41 v16.76,12.7 | v22.61,15.75 21.34,17.02 C1.2 | SV2.1 56.9,10.41 55.63,9.14 | 55.63,9.14 54.86,8.38 CN1.2 | IC2.2 42.16,3.05 41.15,4.06 40.64,4.06 | 40.64,4.06 40.13,4.06 38.86,5.33 37.59,5.33 | 37.59,5.33 36.58,5.33 C3.2 36.58,7.11 34.29,9.4 34.29,13.46 | 37.59,5.33 40.89,8.64 IC4.1 41.15,8.89 42.16,9.91 42.67,9.91 43.18,10.41 46.74,10.41 C11.2 46.74,10.67 47.5,11.43 53.34,11.43 55.63,9.14 | 35.05,14.73 35.05,15.75 32.51,18.29 32.51,20.32 33.02,20.83 IC1.21 | C2.2 36.58,13.21 35.31,14.48 | 35.05,14.73 35.31,14.48 | 35.05,14.73 RC.1 35.31,14.48 | 35.31,14.48 34.29,13.46 | 34.29,13.46 30.23,9.4 X1.GND | 6.35,21.34 5.08,20.07 2.54,20.07 CTC2.2 | v23.37,30.73 26.16,27.94 RBS.1 | 15.75,32.26 15.24,32.26 IC6.1 | 15.75,32.26 v17.02,32.26 | 11.94,29.72 12.95,30.73 14.22,30.73 15.75,32.26 | 11.94,29.72 5.84,23.62 5.84,23.11 6.35,22.61 CTC1.2 6.35,21.34 | 20.57,47.5 20.57,44.7 RJ45.SHIELD1 | 20.57,47.5 20.57,49.28 | 20.57,49.28 20.57,50.55 C13.1 | 8.13,50.55 14.48,50.55 RJ45.G- 14.48,50.29 15.49,49.28 20.57,49.28 | 8.13,50.55 6.35,50.55 RJ45.Y- | 2.54,42.42 5.84,39.12 5.84,36.58 RJ45.GND 6.1,36.58 6.1,35.56 11.94,29.72 | 2.54,42.42 8.13,42.42 | 8.13,42.42 ISP.6 | 2.54,42.42 RJ45.SHIELD0 | 8.13,42.42 8.13,50.55 | 46.48,50.55 46.48,52.32 49.02,54.86 49.53,54.86 C12.1 49.53,55.12 49.78,55.37 57.4,55.37 | 46.48,50.55 46.48,49.28 CX4.2 | 57.4,55.37 57.91,55.37 60.96,52.32 62.48,52.32 U$1.P$1
  Top 0.254: 57.4,55.37 C6.2 | 48.77,26.42 RTC.4 48.51,26.42 47.24,26.42 46.74,26.92 46.23,26.92 | 41.66,28.45 40.64,27.43 | 40.64,27.43 39.88,26.67 IC1.3 | 41.66,28.45 41.66,29.46 C4.1 | 41.66,28.45 39.12,28.45 38.61,27.94 IC1.5 | 41.91,25.91 41.91,26.16 40.64,27.43 | 41.91,25.91 41.91,25.65 43.69,23.88 43.69,23.37 43.43,23.11 43.43,20.57 43.94,20.07 44.2,20.07 44.7,19.56 C5.1 | 41.91,25.91 X.2 45.21,25.91 46.23,26.92 | 44.7,37.59 44.96,37.34 | 44.96,37.34 46.23,36.07 | 46.23,36.07 47.5,34.8 47.5,33.02 CX3.2 | IC7.18 44.7,37.59 | 29.21,51.31 29.21,52.83 30.73,54.36 RM3.1 | 29.21,51.31 29.21,50.55 | 29.21,50.55 CAP.2 29.21,50.29 | 29.21,51.31 31.5,49.02 IC7.2 34.04,49.02 v40.13,42.93 41.66,41.4 IC7.21 41.91,41.4 41.91,41.91 | IC7.11 35.56,37.59 v39.12,41.15 | 41.91,41.91 41.91,42.67 IC7.22 | 44.7,37.59 44.7,39.12 41.91,41.91 | v46.23,28.19 46.23,26.92 | v44.45,32.26 44.45,34.54 44.96,35.05 44.96,37.34 | 46.48,50.55 48.77,50.55 49.28,50.04 49.28,49.78 | 49.28,49.78 49.28,42.93 48.26,41.91 48.26,38.1 46.23,36.07 | 49.28,49.78 v49.53,49.78 | 20.57,47.5 26.16,47.5 29.21,50.55 | 6.35,21.34 v8.38,19.3
  Bottom 0.254: v22.61,15.75 19.81,15.75 v16.76,12.7 15.24,14.22 13.46,14.22 v8.38,19.3 | v23.37,30.73 22.1,30.73 20.57,32.26 v17.02,32.26 | 66.29,41.91 66.29,48.77 67.06,49.53 MICROSD.P$1 | 66.29,41.91 66.29,40.13 MICROSD.GND3 | N5110.2 62.48,35.81 62.48,37.85 63.75,39.12 63.75,39.37 65.79,41.4 | 66.29,41.91 65.79,41.4 | 65.79,41.4 57.4,41.4 56.39,40.39 56.39,39.62 MICROSD.6 56.13,39.37 56.13,38.86 55.63,38.35 52.32,38.35 51.82,38.86 51.82,40.13 MICROSD.GND1 51.82,40.39 51.82,49.53 MICROSD.P$2 51.56,49.78 v49.53,49.78 | v39.12,41.15 39.12,41.91 v40.13,42.93 | v46.23,28.19 46.23,30.48 v44.45,32.26
LEDA  (via drill 0.61)
  Top 0.254: v24.89,51.31 27.43,53.85 27.43,54.36 REA1.2
  Bottom 0.254: v24.89,51.31 17.78,51.31 17.02,50.55 RJ45.G+
LEDB
  Top 0.254: REB1.2 22.61,54.36 22.1,53.85 22.1,53.59 20.32,51.82 5.08,51.82 3.81,50.55 RJ45.Y+
MISO  (via drill 0.61)
  Top 0.254: v22.35,26.67 27.43,26.67 28.45,25.65 30.73,25.65 IC1.16 | v14.22,27.94 14.22,26.42 13.97,26.16 IC6.7 | v50.55,42.16 v53.09,42.16 | v35.05,43.69 34.8,43.94 IC7.6 31.75,43.94 30.99,44.7 22.86,44.7 19.05,40.89 16.51,40.89 13.21,44.2 13.21,45.47 11.94,46.74 ISP.1
  Bottom 0.254: v14.22,27.94 17.27,24.89 17.78,24.89 20.32,27.43 21.08,27.43 21.84,26.67 v22.35,26.67 23.88,26.67 31.75,34.54 31.75,38.35 35.05,41.66 v35.05,43.69 35.05,48.51 36.83,50.29 42.42,50.29 v50.55,42.16 | v53.09,42.16 54.86,40.39 54.86,39.62 MICROSD.7
MOSI  (via drill 0.61)
  Top 0.254: v29.72,27.69 31.24,26.16 IC1.15 | v35.05,40.39 32.77,42.67 IC7.7 | v50.8,35.05 50.8,34.29 49.53,33.02 | 49.53,33.02 47.75,31.24 40.64,31.24 v36.07,35.81 | v18.54,56.13 20.07,56.13 21.08,57.15 43.18,57.15 44.45,55.88 v44.45,49.53 | v50.55,43.43 49.53,42.42 49.53,33.02
  Bottom 0.254: v29.72,27.69 35.05,33.02 35.05,35.81 | v35.05,40.39 35.05,35.81 | v50.8,35.05 55.63,35.05 59.44,38.86 59.44,39.37 MICROSD.3 | 35.05,35.81 v36.07,35.81 | ISP.4 9.4,45.72 10.67,46.99 10.67,48.26 v18.54,56.13 | v50.55,43.43 v44.45,49.53
N$1
  Top 0.254: J1.6 66.55,1.52 66.55,2.29 67.82,3.56 67.82,5.84 66.55,7.11 J1.3
N$2  (via drill 0.61)
  Top 0.254: v38.61,29.97 37.59,28.96 IC1.7 | v46.48,24.64 44.7,24.64 X.1
  Bottom 0.254: v38.61,29.97 41.15,29.97 v46.48,24.64
N$3  (via drill 0.61)
  Top 0.254: v36.32,27.69 36.32,28.7 36.83,29.21 IC1.8 | v42.16,27.69 44.2,27.69 44.7,27.18 X.3
  Bottom 0.254: v42.16,27.69 v36.32,27.69
N$5
  Top 0.254: IC2.1 41.4,2.29 41.4,1.78 41.66,1.52 44.45,1.52 46.99,4.06 CHG.C
N$6  (via drill 0.61)
  Top 0.254: v41.15,7.37 41.15,5.33 IC2.5 | v37.59,12.45 37.59,14.22 37.08,14.73 RC.2
  Bottom 0.254: v41.15,7.37 41.15,8.89 v37.59,12.45
N$8  (via drill 0.61)
  Top 0.254: FB1.1 19.81,32 13.97,37.85 10.67,37.85 9.65,36.83 v9.65,35.05
  Bottom 0.254: v9.65,35.05 5.33,30.73 TCPL.2
N$9  (via drill 0.61)
  Top 0.254: CTCP.1 15.24,24.13 15.75,24.13 v17.53,25.91 | v21.59,29.97 21.59,31.24 FB1.2 | v13.97,34.04 13.97,32.51 IC6.2
  Bottom 0.254: v21.59,29.97 19.81,28.19 | 19.81,28.19 v17.53,25.91 | 19.81,28.19 v13.97,34.04
N$10  (via drill 0.61)
  Top 0.254: v54.1,12.19 49.02,12.19 44.45,16.76 RN1.4 | v48.01,6.1 48.01,3.05 46.99,2.03 CHG.A
  Bottom 0.254: v48.01,6.1 v54.1,12.19
N$11  (via drill 0.61)
  Top 0.254: FB2.1 25.15,25.65 26.92,25.65 29.46,23.11 29.46,20.57 26.16,17.27 25.15,17.27 23.88,16 v23.88,13.97 | v4.83,21.34 4.83,26.42 5.33,26.92 TCPL.1
  Bottom 0.254: v23.88,13.97 23.37,13.97 18.54,9.14 13.72,9.14 4.83,18.03 v4.83,21.34
N$12  (via drill 0.61)
  Top 0.254: v16.76,22.1 CTCP.2 | v23.62,22.86 24.38,22.86 FB2.2 | v12.7,34.04 12.7,32.51 IC6.3
  Bottom 0.254: v23.62,22.86 22.86,22.1 v16.76,22.1 15.75,21.08 11.43,21.08 10.41,22.1 10.41,24.64 12.7,26.92 v12.7,34.04
N$21  (via drill 0.61)
  Top 0.254: v50.55,30.23 48.77,30.23 RTC.1 | v49.53,23.88 49.53,20.07 X2.2
  Bottom 0.254: v50.55,30.23 49.53,29.21 v49.53,23.88
N$30  (via drill 0.61)
  Top 0.254: v50.55,28.96 48.77,28.96 RTC.2
  Bottom 0.254: v50.55,28.96 50.55,23.62 X2.1
N$34  (via drill 0.61)
  Top 0.254: v27.18,56.13 25.91,54.86 25.91,54.36 REA1.1 | v39.37,51.82 39.37,51.05 41.4,49.02 IC7.27
  Bottom 0.254: v27.18,56.13 35.05,56.13 v39.37,51.82
N$37  (via drill 0.61)
  Top 0.254: v21.08,55.88 21.08,54.36 REB1.1 | v38.1,51.82 38.1,51.05 41.4,47.75 IC7.26
  Bottom 0.254: v21.08,55.88 25.4,55.88 29.46,51.82 v38.1,51.82
N$39  (via drill 0.61)
  Top 0.254: v30.73,48.51 29.21,48.51 CAP.1 | v34.04,50.04 32.77,50.04 32.51,50.29 IC7.1
  Bottom 0.254: v30.73,48.51 32.51,48.51 v34.04,50.04
N$41  (via drill 0.61)
  Top 0.254: v45.97,35.05 45.97,33.02 CX3.1 | v40.13,45.21 IC7.24
  Bottom 0.254: v45.97,35.05 45.97,42.42 47.24,43.69 X3.2 47.24,43.94 44.45,46.74 43.43,46.74 41.91,45.21 v40.13,45.21
N$42
  Top 0.254: 42.42,43.94 43.18,43.94 48.01,48.77 48.01,49.28 CX4.1 | 42.42,43.94 47.24,39.12 X3.1 | 42.42,43.94 IC7.23
N$54  (via drill 0.61)
  Top 0.254: RR-.1 26.16,35.31 26.16,36.07 23.62,38.61 23.62,39.62 RR+.2 23.37,39.62 21.84,41.15 v21.84,41.91 | v22.35,48.51 22.35,50.55 C13.2
  Bottom 0.254: v22.35,48.51 22.35,44.2 21.84,43.69 v21.84,41.91
N$59
  Top 0.254: RBS.2 28.19,27.94 28.19,29.72 32.26,33.78 IC7.14
RD+  (via drill 0.61)
  Top 0.254: v25.4,38.1 25.4,39.62 RR+.1 | v30.23,35.05 IC7.13
  Bottom 0.254: RJ45.RD+ 12.45,39.12 13.72,40.39 15.75,40.39 18.03,38.1 v25.4,38.1 28.45,35.05 v30.23,35.05
RD-
  Top 0.254: 28.19,35.31 29.21,35.31 30.23,36.32 IC7.12 | 28.19,35.31 26.92,34.04 25.4,34.04 25.15,34.29 25.15,34.8 19.56,40.39 9.4,40.39 8.64,39.62 8.64,36.58 RJ45.RD- | 28.19,35.31 RR-.2
RESET  (via drill 0.61)
  Top 0.254: v40.64,17.02 40.64,20.32 39.37,21.59 IC1.29 | v58.67,12.45 57.91,12.45 55.37,14.99 RRST.1 | v64.77,48.51 v64.77,39.12 | v37.59,56.13 30.48,56.13 28.7,54.36 28.7,53.34 v25.91,50.55 | v2.03,24.13 2.03,35.05 v4.83,37.85
  Bottom 0.254: v40.64,17.02 36.58,12.95 36.58,5.08 | 36.58,5.08 38.86,2.79 55.37,2.79 58.67,6.1 v58.67,12.45 | N5110.1 57.66,33.53 57.66,32.51 58.42,31.75 60.96,31.75 62.99,33.78 62.99,37.34 v64.77,39.12 | v64.77,48.51 64.77,52.83 60.45,57.15 38.61,57.15 v37.59,56.13 | v25.91,50.55 23.88,48.51 ETHRESETS.1 23.88,43.43 ETHRESET.2 23.37,42.16 22.1,40.89 17.78,40.89 16.26,42.42 ISP.5 10.67,41.15 7.62,41.15 4.83,38.35 v4.83,37.85 | 36.58,5.08 27.69,5.08 24.64,2.03 4.06,2.03 2.03,4.06 v2.03,24.13
RXD
  Top 0.254: SV2.3 59.44,15.49 58.17,16.76 45.21,16.76 39.88,22.1 IC1.30
SCK  (via drill 0.61)
  Top 0.254: v6.86,23.37 9.91,20.32 D2.C | v20.57,20.57 22.35,22.35 22.35,24.64 23.88,26.16 27.18,26.16 29.97,23.37 30.73,23.37 IC1.17 | v61.47,37.59 61.47,38.61 57.66,42.42 v57.66,44.45 | IC7.8 30.73,41.4 v28.45,43.69 | v26.67,49.28 25.65,49.28 v22.35,52.58
  Bottom 0.254: 10.16,43.69 10.67,43.69 ISP.3 | 10.16,43.69 8.89,43.69 8.13,42.93 8.13,42.42 3.81,38.1 3.81,26.42 v6.86,23.37 9.65,20.57 v20.57,20.57 | v61.47,37.59 62.48,38.61 62.48,40.39 61.98,40.89 57.91,40.89 57.4,40.39 57.4,39.62 MICROSD.5 | v57.66,44.45 52.83,49.28 52.83,50.8 51.31,52.32 40.13,52.32 35.31,57.15 21.08,57.15 16.51,52.58 | 16.51,52.58 15.75,51.82 15.75,49.28 10.16,43.69 | v28.45,43.69 28.45,47.5 v26.67,49.28 | 16.51,52.58 v22.35,52.58
SCK1  (via drill 0.61)
  Top 0.254: v19.05,24.64 19.05,23.11 17.02,21.08 15.24,21.08 12.7,18.54 9.91,18.54 D2.A | v20.83,26.42 20.83,27.69 21.08,27.94 RTCP1.2 | v11.43,24.38 11.43,25.91 IC6.5
  Bottom 0.254: v20.83,26.42 v19.05,24.64 18.8,24.38 v11.43,24.38
SCL  (via drill 0.61)
  Top 0.254: 56.39,28.45 56.39,30.48 55.88,30.99 53.59,30.99 52.32,32.26 52.32,33.78 RN3.1 | 56.39,28.45 55.63,27.69 55.12,27.69 RTC.6 54.86,27.43 53.85,27.43 v51.82,25.4 | v37.34,22.1 38.35,21.08 IC1.28 | U$1.P$6 63.75,55.88 64.52,55.12 66.8,55.12 67.06,54.86 v67.06,38.61 | 56.39,28.45 58.17,26.67 60.96,26.67 SV2.6
  Bottom 0.254: v37.34,22.1 39.62,22.1 41.66,20.07 48.51,20.07 51.82,23.37 v51.82,25.4 | v67.06,38.61 68.07,37.59 68.07,26.67 SV2.6
SDA  (via drill 0.61)
  Top 0.254: RN3.2 53.34,33.78 53.34,33.27 53.59,33.02 v55.88,33.02 v55.88,41.15 | RTC.5 54.86,26.16 v55.88,25.15 55.88,24.89 | v39.62,19.81 38.61,19.81 38.1,20.32 IC1.27 | v45.72,18.03 46.99,18.03 47.5,17.53 48.51,17.53 55.88,24.89 | v60.71,55.63 61.47,56.39 U$1.P$7 | SV2.5 60.96,24.13 56.64,24.13 55.88,24.89
  Bottom 0.254: v55.88,25.15 v55.88,33.02 | v39.62,19.81 41.15,19.81 42.42,18.54 45.21,18.54 v45.72,18.03 | v60.71,55.63 60.71,45.97 v55.88,41.15
TCT  (via drill 0.61)
  Top 0.254: v59.69,48.26 59.69,46.74 L1.1 59.94,46.74 59.94,42.67 64.52,38.1 64.77,38.1 65.53,37.34 65.53,31.75 62.48,28.7 62.48,27.69 63.25,26.92 65.79,26.92 66.55,26.16 v66.55,16.51 | v54.86,53.09 49.53,53.09 C12.2 | RT-.1 24.13,31.75 21.08,34.8 RT+.2 21.08,35.05 v18.54,35.05 | v26.92,2.29 25.15,2.29 24.89,2.03 22.86,2.03 v20.57,4.32 | v3.05,23.11 3.05,26.92 5.33,29.21 v6.6,29.21
  Bottom 0.254: v54.86,53.09 v59.69,48.26 | RJ45.P4 11.94,36.58 12.95,35.56 | 12.95,35.56 13.46,35.05 v18.54,35.05 | v66.55,16.51 66.55,9.91 62.74,6.1 59.69,6.1 55.88,2.29 v26.92,2.29 | v20.57,4.32 9.65,4.32 4.83,9.14 4.06,9.14 3.05,10.16 v3.05,23.11 | 12.95,35.56 v6.6,29.21
TD+  (via drill 0.61)
  Top 0.254: RT+.1 21.08,36.83 17.27,36.83 14.99,39.12 RJ45.TD+ | IC7.17 41.15,36.32 v39.62,37.85 | v34.04,45.97 v38.1,41.91
  Bottom 0.254: v39.62,37.85 39.62,39.37 38.1,40.89 v38.1,41.91 | v34.04,45.97 34.04,44.2 31.24,41.4 31.24,34.8 30.48,34.04 27.94,34.04 24.38,37.59 16.51,37.59 14.99,39.12 RJ45.TD+
TD-  (via drill 0.61)
  Top 0.254: v27.43,33.27 27.43,31.75 RT-.2 | IC7.16 41.15,35.05 38.61,37.59 38.61,39.37 40.13,40.89 40.13,41.4 v34.04,47.5
  Bottom 0.254: v27.43,33.27 21.59,33.27 18.29,36.58 RJ45.TD- 13.21,36.58 11.18,38.61 11.18,39.62 12.45,40.89 16,40.89 16.51,40.39 26.42,40.39 33.53,47.5 v34.04,47.5
TXD  (via drill 0.61)
  Top 0.254: v42.42,22.1 40.89,22.1 40.39,22.61 IC1.31 | v48.26,23.88 49.28,24.89 51.05,24.89 v52.83,23.11 | v54.86,22.61 58.42,19.05 63.5,19.05 SV2.4
  Bottom 0.254: v42.42,22.1 46.48,22.1 v48.26,23.88 | v52.83,23.11 54.36,23.11 v54.86,22.61
V_CON  (via drill 0.61)
  Top 0.254: IC7.15 42.42,33.78 v43.69,35.05 | v43.69,38.61 42.16,38.61 41.91,38.86 | 41.91,38.86 41.91,40.13 IC7.20 | 41.91,38.86 IC7.19 | 42.67,46.74 43.18,47.24 43.18,49.53 42.42,50.29 IC7.28 41.66,50.29 41.66,51.82 39.12,54.36 | 42.67,46.74 42.42,46.48 IC7.25 42.67,46.74 | 39.12,54.36 42.67,54.36 ETHPWR.2 | 39.12,54.36 RM4.2 | 42.67,46.74 v43.69,45.72 | v27.43,16.26 26.16,16.26 Q2.3 | N5110.7 N5110.6 | v58.67,50.55 58.67,42.16 64.26,36.58 LCD.2
  Bottom 0.254: v43.69,35.05 v43.69,38.61 v43.69,45.72 | LCD.2 64.26,30.48 61.72,27.94 61.72,24.89 N5110.6 | v27.43,16.26 27.43,17.27 29.72,19.56 38.61,19.56 40.13,18.03 44.45,18.03 45.47,17.02 56.39,17.02 N5110.7 | ETHPWR.2 44.96,56.64 53.34,56.64 58.67,51.31 v58.67,50.55
VBAT
  Top 0.254: J1.5 64.01,1.52 64.77,1.52 66.04,2.79 66.29,2.79 67.31,3.81 67.31,4.83 66.04,6.1 65.02,6.1 64.01,7.11 J1.2 64.01,7.37 62.99,7.37 62.23,8.13 58.17,8.13 55.63,5.59 53.85,5.59 52.07,7.37 | 52.07,7.37 52.83,8.13 CN1.1 | 52.07,7.37 51.82,7.11 47.75,7.11 43.18,2.54 IC2.3
VBUS  (via drill 0.61)
  Top 0.254: v42.16,6.1 42.93,5.33 IC2.4 | RN1.5 41.91,16.76 41.66,16.76 v40.39,15.49 v39.12,16.76 | v24.89,15.75 25.15,15.49 25.15,13.97 Q2.1 | v22.86,17.78 21.84,18.8 21.34,18.8 C1.1 | v25.91,10.92 26.67,10.16 26.67,9.4 X1.VBUS | v29.46,3.3 v33.27,7.11 | v2.79,2.03 2.79,3.56 4.83,5.59 5.59,5.59 6.6,6.6 v6.6,9.91
  Bottom 0.254: v40.39,15.49 40.39,14.22 39.37,13.21 39.37,11.43 42.16,8.64 v42.16,6.1 | v22.86,17.78 24.38,16.26 | 24.38,16.26 v24.89,15.75 25.91,14.73 v25.91,10.92 | ISP.2 9.4,46.74 7.62,44.96 7.62,42.67 3.3,38.35 3.3,24.13 4.83,22.61 | 4.83,22.61 7.37,20.07 7.37,18.29 13.97,11.68 19.81,11.68 24.38,16.26 | v39.12,16.76 39.12,16.26 33.27,10.41 v33.27,7.11 | v29.46,3.3 26.67,3.3 24.89,1.52 3.3,1.52 v2.79,2.03 | v6.6,9.91 6.6,15.49 3.81,18.29 3.81,21.59 4.83,22.61
VCC  (via drill 0.61)
  Top 0.254: 44.2,8.89 46.74,8.89 C11.1 | 44.2,8.89 42.93,8.89 IC4.2 | v39.12,3.81 36.58,3.81 C3.1 | 44.2,8.89 v44.2,6.6 | RRST.2 53.59,14.99 54.1,14.48 54.1,14.22 56.9,11.43 62.99,11.43 SV2.2 65.28,12.95 68.07,15.75 68.07,35.05 LCD.1 66.8,37.59 65.79,38.61 65.79,48.77 64.77,49.78 | 64.77,49.78 65.02,50.04 U$1.P$3 65.02,54.36 | 64.77,49.78 62.48,47.5 | 62.48,47.5 61.72,46.74 L1.2 | 65.02,54.36 U$1.P$8 60.71,54.36 58.42,56.64 49.28,56.64 47.5,54.86 ETHPWR.1 | 65.02,54.36 U$1.P$4 65.79,54.36 | 6.35,17.27 6.35,15.75 5.59,14.99 | 6.35,17.27 CTC1.1 | 5.59,14.99 4.83,14.22 THM1.2 | 5.59,14.99 3.3,17.27 | 3.3,17.27 1.27,19.3 1.27,20.32 2.54,21.59 CTC2.1 | THM2.2 4.83,8.38 3.3,9.91 3.3,17.27 | 22.86,11.18 21.08,9.4 RU.2 | 22.86,11.18 23.62,11.94 25.91,11.94 26.92,12.95 26.92,13.72 Q2.2 27.18,13.97 27.69,13.97 v28.7,14.99 | 11.43,32.26 IC6.4 11.43,32.51 11.43,34.04 12.45,35.05 15.49,35.05 18.8,31.75 18.8,28.45 19.3,27.94 RTCP1.1 19.56,27.94 19.56,26.42 20.57,25.4 21.34,25.4 21.84,24.89 21.84,23.88 20.57,22.61 RTCP2.1 20.57,22.35 19.05,22.35 18.8,22.1 | 18.8,22.1 14.73,18.03 DHT22.1 14.48,18.03 13.72,17.27 6.35,17.27 | 18.8,22.1 18.8,15.24 | 18.8,15.24 22.86,11.18 | 18.8,15.24 RH.1 | 54.1,45.21 54.1,41.91 53.34,41.15 v53.34,37.34 53.34,35.31 RN3.7 53.09,35.31 RN3.8 52.07,35.05 51.56,34.54 51.56,28.7 | 57.4,53.09 57.4,48.51 54.1,45.21 | 57.4,53.09 C6.1 | 54.1,45.21 RSD.2 | 37.34,25.15 39.12,26.92 IC1.4 | 37.34,25.15 37.08,24.89 33.53,24.89 31.5,22.86 IC1.18 31.24,22.61 30.73,22.1 30.73,21.08 28.7,19.05 v28.7,17.27 | 37.34,25.15 37.34,27.69 37.85,28.19 IC1.6 38.1,28.45 38.61,28.96 39.12,28.96 40.89,30.73 42.42,30.73 43.69,29.46
  Top 0.254: 43.69,29.46 46.23,29.46 48.01,27.69 48.51,27.69 RTC.3 48.77,27.69 50.55,27.69 51.56,28.7 | 51.56,28.7 52.83,29.97 54.86,29.97 RTC.8 | 43.69,29.46 C4.2 | 62.48,47.5 59.69,50.29 59.69,50.8 57.4,53.09
  Bottom 0.254: v39.12,3.81 41.4,3.81 v44.2,6.6 47.24,6.6 54.1,13.46 61.47,13.46 61.98,12.95 SV2.2 | v53.34,37.34 56.9,37.34 58.17,38.61 58.17,39.37 MICROSD.4 | v28.7,17.27 v28.7,14.99
VDD  (via drill 0.61)
  Top 0.254: 60.71,6.35 60.71,3.81 61.47,3.05 61.47,1.52 J1.4 | 60.71,6.35 61.47,7.11 J1.1 | 40.64,10.92 38.86,10.92 37.08,9.14 36.58,9.14 C2.1 | 40.64,10.92 41.91,10.92 IC4.3 | v57.66,6.35 60.71,6.35 | v49.02,10.41 v51.31,8.13 | 40.64,10.92 v40.64,11.43
  Bottom 0.254: v57.66,6.35 53.09,6.35 v51.31,8.13 | v49.02,10.41 41.66,10.41 v40.64,11.43

### Text on the board
tPlace: RESET | GND | D3 | D4 | A1 | T+ | D5 | A0 | VCON | SCL | SDA | VCON | TXD | GND | + | RXD | VCC | GND | +
bPlace: MISO | GND | Open-Lab-Monitor | hackerfarm01007.org | VUSB-REVA
tNames: T-